# Altium project Stabilizer.PrjPCB (part 3 of 5)

## Sheet RMII_Ethernet.SchDoc: Stabilizer
size 420 x 297 mm; Author: G.Kasprowicz; CompanyName: WUT ISE; DrawnBy: G.Kasprowicz; Organization: WUT ISE; Address1: PW ISE; Address2: Nowowiejska 15/19 00-665 Warsaw; Address3: gkasprow@gmail.com; DocumentNumber: 4; Revision: 3.4; SheetNumber: 4; SheetTotal: 11; ModifiedBy: -; CheckedDate: -; Title2: Ethernet; DivGrp: WUT ISE; Designer: G.Kasprowicz; ModifiedDate: -; ProjectName: Sensor Box
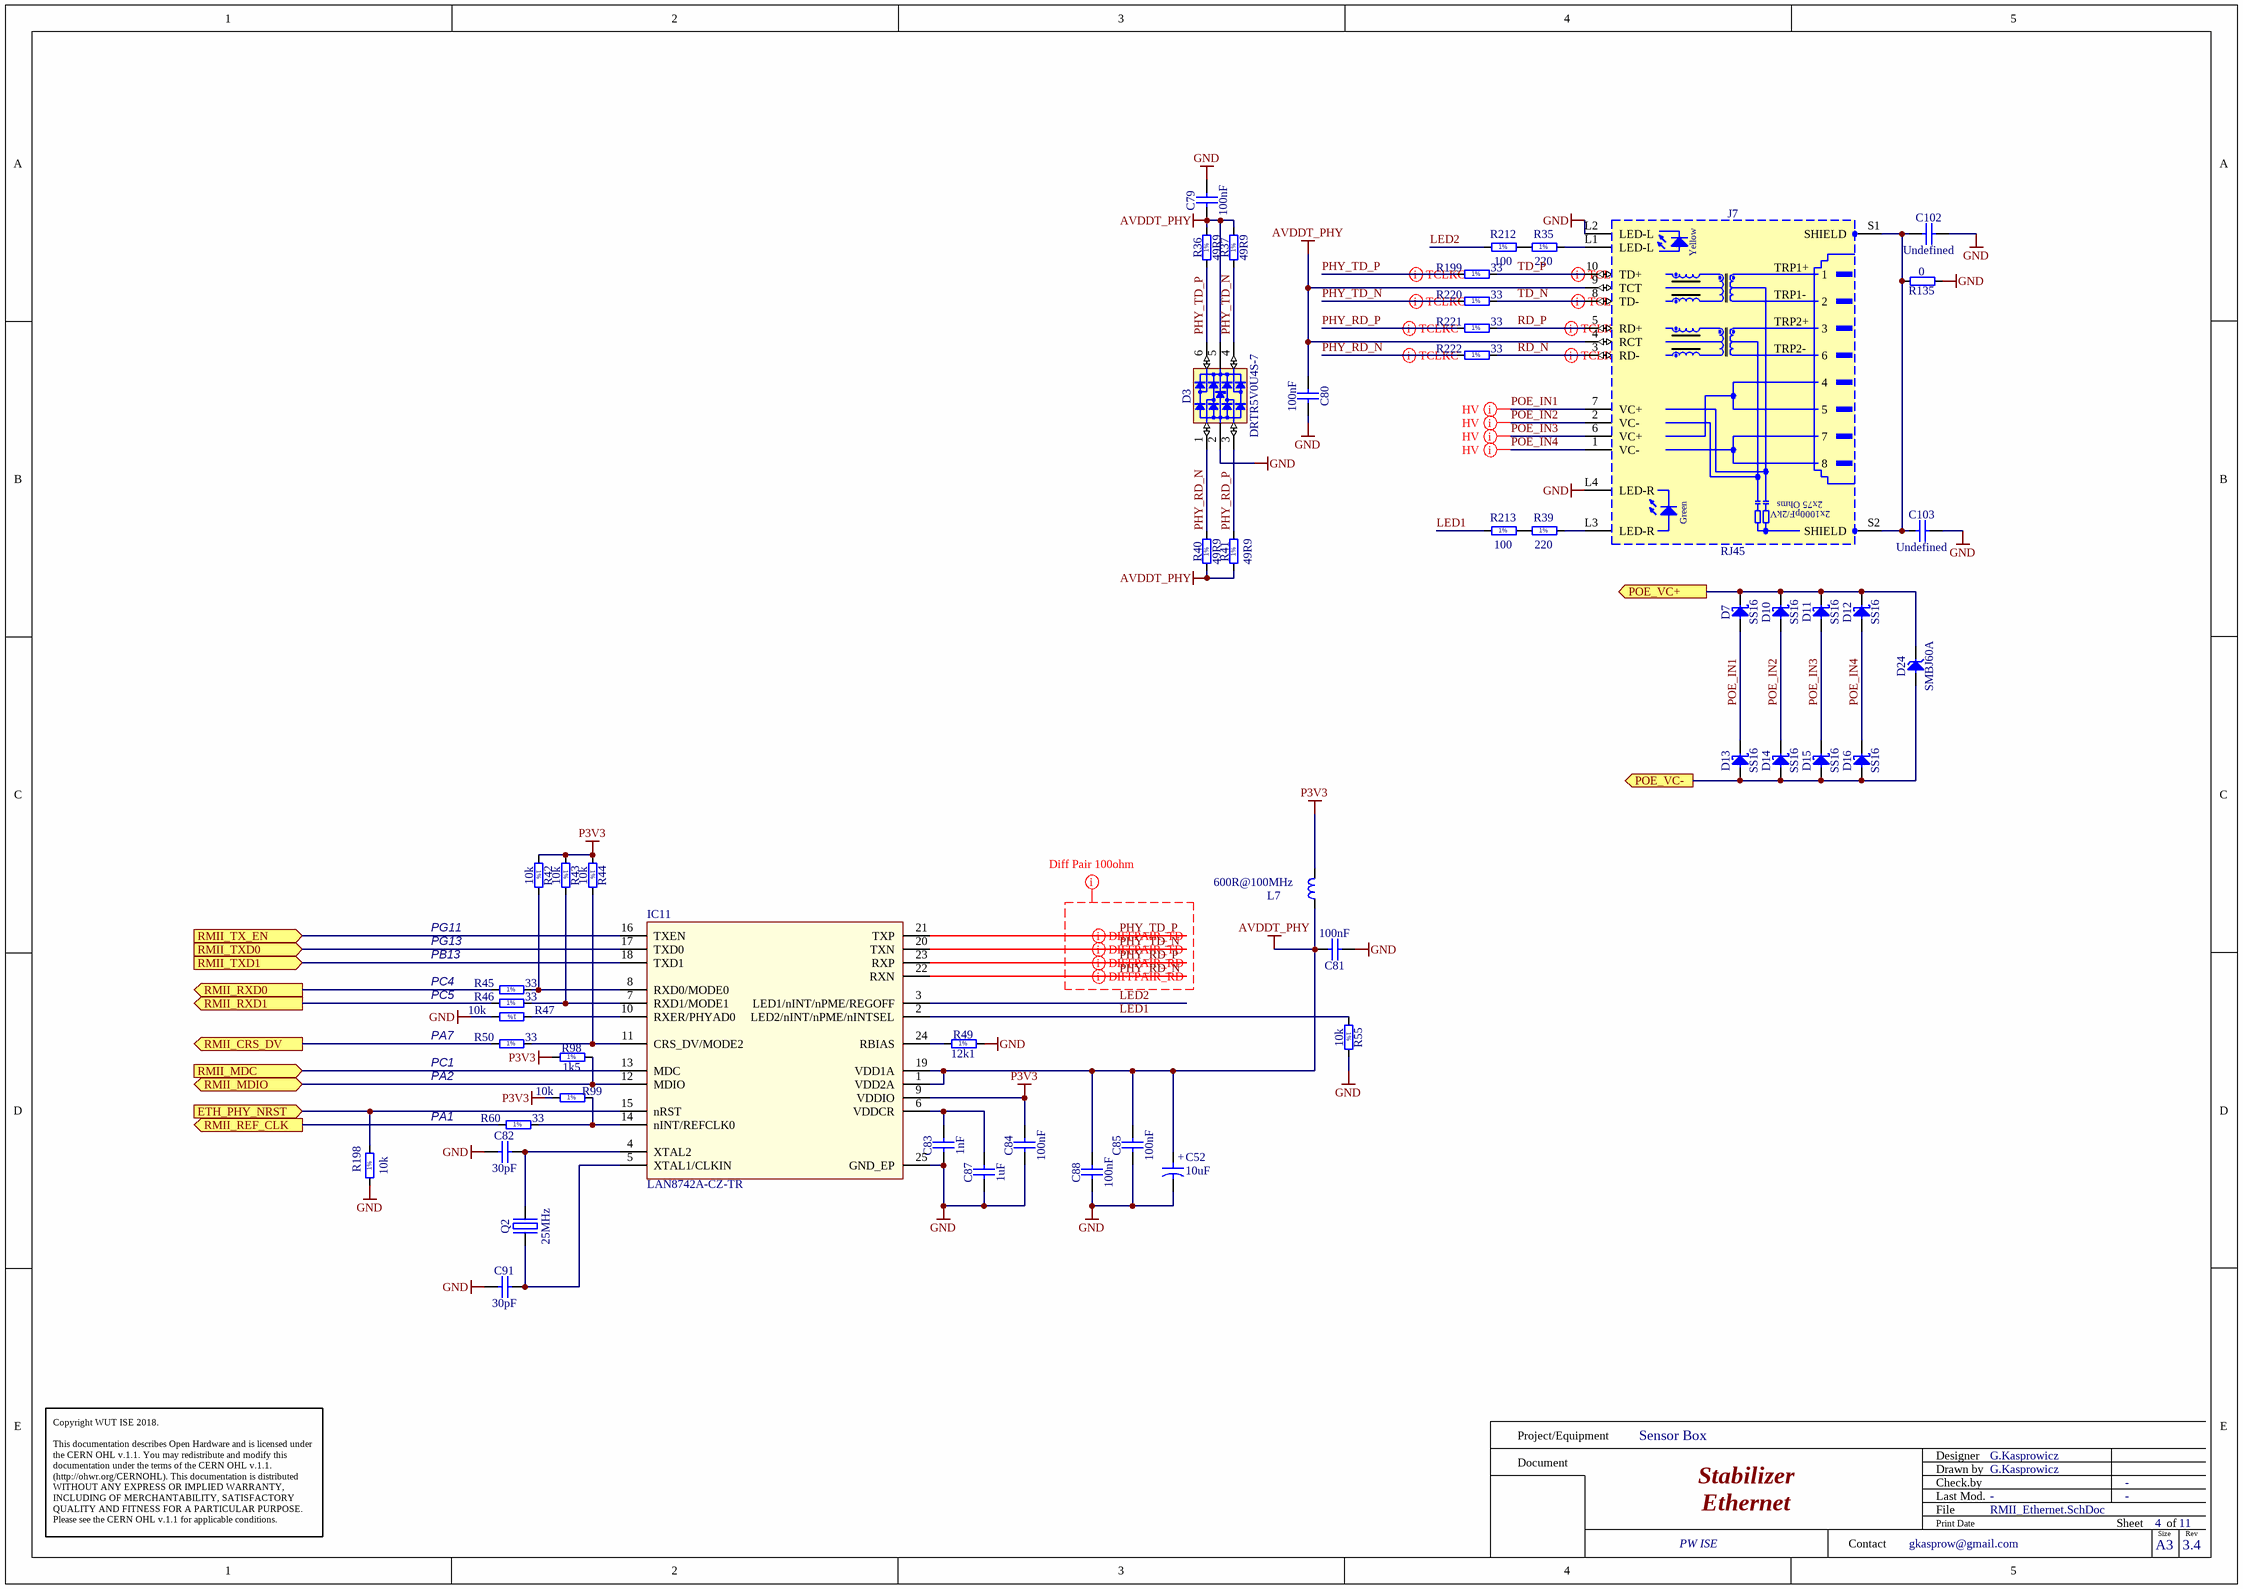
[diagram p2: RMII_Ethernet.SchDoc]

### Parts
C52  10uF  [CAPMP3216X180N]
C79  100nF  [CAPC1005X55N]
C80  100nF  [CAPC1005X55N]
C81  100nF  [CAPC1005X55N]
C82  30pF  [CAPC1005X55N]
C83  1nF  [CAPC1005X55N]
C84  100nF  [CAPC1005X55N]
C85  100nF  [CAPC1005X55N]
C87  1uF  [CAPC1608X87N]
C88  100nF  [CAPC1005X55N]
C91  30pF  [CAPC1005X55N]
C102  Undefined  [CAPC2012X135N]
C103  Undefined  [CAPC2012X135N]
D3  DRTR5V0U4S-7  [SOT65P210X110-6N]
D7  SS16  [DIOM5127X229N]
D10  SS16  [DIOM5127X229N]
D11  SS16  [DIOM5127X229N]
D12  SS16  [DIOM5127X229N]
D13  SS16  [DIOM5127X229N]
D14  SS16  [DIOM5127X229N]
D15  SS16  [DIOM5127X229N]
D16  SS16  [DIOM5127X229N]
D24  SMBJ60A  [DIOM5336X265N]
IC11  LAN8742A-CZ-TR  [QFN24_0R5_4X4]
J7  RJ45  [ABRACON_ARJM11C7-114-BA-EW2]
L7  600R@100MHz  [INDC1005X55N]
Q2  25MHz  [XTAL_ABRACON_ABLS]
R35  220  [RESC1608X55N]
R36  49R9  [RESC1005X40N]
R37  49R9  [RESC1005X40N]
R39  220  [RESC1608X55N]
R40  49R9  [RESC1005X40N]
R41  49R9  [RESC1005X40N]
R42  10k  [RESC1005X40N]
R43  10k  [RESC1005X40N]
R44  10k  [RESC1005X40N]
R45  33  [RESC1005X40N]
R46  33  [RESC1005X40N]
R47  10k  [RESC1005X40N]
R49  12k1  [RESC1005X40N]
R50  33  [RESC1005X40N]
R55  10k  [RESC1005X40N]
R60  33  [RESC1005X40N]
R98  1k5  [RESC1005X40N]
R99  10k  [RESC1005X40N]
R135  0  [RESC1608X55N]
R198  10k  [RESC1005X40N]
R199  33  [RESC1005X40N]
R212  100  [RESC1005X40N]
R213  100  [RESC1005X40N]
R220  33  [RESC1005X40N]
R221  33  [RESC1005X40N]
R222  33  [RESC1005X40N]

### Ports
ETH_PHY_NRST (in), POE_VC+ (out), POE_VC- (out), RMII_CRS_DV (out), RMII_MDC (in), RMII_MDIO (bidir), RMII_REF_CLK (out), RMII_RXD0 (out), RMII_RXD1 (out), RMII_TX_EN (in), RMII_TXD0 (in), RMII_TXD1 (in)

### Nets
AVDDT_PHY: C52.1 C79.1 C80.2 C81.2 C85.2 C88.2 D3.5(VBUS) IC11.1(VDD2A) IC11.19(VDD1A) J7.4(RCT) J7.9(TCT) L7.1 R36.2 R37.2 R40.1 R41.1
GND: C52.2 C79.2 C80.1 C81.1 C82.1 C83.1 C84.1 C85.1 C87.1 C88.1 C91.1 C102.2 C103.2 D3.2(GND) IC11.25(GND_EP) J7.L2(LED-L) J7.L4(LED-R) R47.2 R49.2 R55.2 R135.1 R198.1
P3V3: C84.2 IC11.9(VDDIO) L7.2 R42.1 R43.1 R44.1 R98.1 R99.1
ETH_PHY_NRST: IC11.15(nRST) R198.2 ; port ETH_PHY_NRST
LED1: IC11.2(LED2/nINT/nPME/nINTSEL) R55.1 R213.1
LED2: IC11.3(LED1/nINT/nPME/REGOFF) R212.1
PHY_RD_N: D3.1(I/O1) IC11.22(RXN) R40.2 R222.1
PHY_RD_P: D3.3(I/O2) IC11.23(RXP) R41.2 R221.1
PHY_TD_N: D3.4(I/O3) IC11.20(TXN) R37.1 R220.1
PHY_TD_P: D3.6(I/O4) IC11.21(TXP) R36.1 R199.1
POE_IN1: D7.2(A) D13.1(C) J7.7(VC+)
POE_IN2: D10.2(A) D14.1(C) J7.2(VC-)
POE_IN3: D11.2(A) D15.1(C) J7.6(VC+)
POE_IN4: D12.2(A) D16.1(C) J7.1(VC-)
POE_VC+: D7.1(C) D10.1(C) D11.1(C) D12.1(C) D24.1(C) ; port POE_VC+
POE_VC-: D13.2(A) D14.2(A) D15.2(A) D16.2(A) D24.2(A) ; port POE_VC-
RD_N: J7.3(RD-) R222.2
RD_P: J7.5(RD+) R221.2
RMII_CRS_DV: R50.1 ; port RMII_CRS_DV
RMII_MDC: IC11.13(MDC) ; port RMII_MDC
RMII_MDIO: IC11.12(MDIO) R98.2 ; port RMII_MDIO
RMII_REF_CLK: R60.1 ; port RMII_REF_CLK
RMII_RXD0: R45.1 ; port RMII_RXD0
RMII_RXD1: R46.1 ; port RMII_RXD1
RMII_TX_EN: IC11.16(TXEN) ; port RMII_TX_EN
RMII_TXD0: IC11.17(TXD0) ; port RMII_TXD0
RMII_TXD1: IC11.18(TXD1) ; port RMII_TXD1
TD_N: J7.8(TD-) R220.2
TD_P: J7.10(TD+) R199.2
NetC82_2: C82.2 IC11.4(XTAL2) Q2.2(OSC2)
NetC83_2: C83.2 C87.2 IC11.6(VDDCR)
NetC91_2: C91.2 IC11.5(XTAL1/CLKIN) Q2.1(OSC1)
NetC102_1: C102.1 C103.1 J7.S1(SHIELD) J7.S2(SHIELD) R135.2
NetIC11_7: IC11.7(RXD1/MODE1) R43.2 R46.2
NetIC11_8: IC11.8(RXD0/MODE0) R42.2 R45.2
NetIC11_10: IC11.10(RXER/PHYAD0) R47.1
NetIC11_11: IC11.11(CRS_DV/MODE2) R44.2 R50.2
NetIC11_14: IC11.14(nINT/REFCLK0) R60.2 R99.2
NetIC11_24: IC11.24(RBIAS) R49.1
NetJ7_L1: J7.L1(LED-L) R35.2
NetJ7_L3: J7.L3(LED-R) R39.2
NetR35_1: R35.1 R212.2
NetR39_1: R39.1 R213.2

### Layout directives
differential pair: PHY_RD_N, PHY_RD_P, PHY_TD_N, PHY_TD_P, RD_N, RD_P, TD_N, TD_P
net class HV: POE_IN1, POE_IN2, POE_IN3, POE_IN4
mark named Diff Pair 100ohm: PHY_RD_N, PHY_RD_P, PHY_TD_N, PHY_TD_P

### Notes on the sheet
- PG11
- PG13
- PB13
- PC4
- PC5
- PA7
- PC1
- PA2
- PA1
- Project/Equipment
- Document
- Designer
- Drawn by
- Check.by
- Copyright WUT ISE 2018.
  This documentation describes Open Hardware and is licensed under the CERN OHL v.1.1. You may redistribute and modify this documentation under the terms of the CERN OHL v.1.1. (http://ohwr.org/CERNOHL). This documentation is distributed WITHOUT ANY EXPRESS OR IMPLIED WARRANTY, INCLUDING OF MERCHANTABILITY, SATISFACTORY QUALITY AND FITNESS FOR A PARTICULAR PURPOSE. Please see the CERN OHL v.1.1 for applicable conditions.
- Contact
- File
- Last Mod.
- Print Date
- Sheet
- Size
- A3
- of
- Rev
- (in symbol CON_ETH_POE_ARJM11C7) Yellow; TRP1+; TRP1-; TRP2+; TRP2-; 2x75 Ohms; Green; 2x1000pF/2kV
- (in symbol CTE3216-18_10UF_16V_20%_AVX_TCJ) +
- (in symbol R0402_1K5_1%_0.0625W_100PPM) 1%
- (in symbol R0402_10K_1%_0.0625W_100PPM) 1%
- (in symbol R0402_12K1_1%_0.0625W_100PPM) 1%
- (in symbol R0402_33R_1%_0.0625W_100PPM) 1%
- (in symbol R0402_49R9_1%_0.0625W_100PPM) 1%
- (in symbol R0402_100R_1%_0.0625W_100PPM) 1%
- (in symbol R0603_220R_1%_0.1W_100PPM) 1%

### Library data of the parts
C52 = CTE3216-18_10UF_16V_20%_AVX_TCJ: Polarised capacitor; Part Description: ESR 0R200 Tantalum Solid Electrolytic Chip Capacitor with Conductive Polymer Electrode; Manufacturer: AVX; Manufacturer Part Number: TCJA106M016R0200; Voltage: 16V; Tolerance: ±20%; Part Number: CTE3216-18_10UF_16V_20%_AVX_TCJ; Component Kind: Standard; Component Type: Standard; Pin Count: 2; Value: 10uF; Status: Preferred; Case: A; Mounted: Yes; Socket: No; SMD: Yes; Sense: No; ComponentHeight: 1.8mm; HelpURL: \\cern.ch\dfs\Applications\Altium\Datasheets\CTE_AVX_TCJ.pdf; Author: CERN DEM JLC; CreateDate: 29.03.2012; LatestRevisionDate: 29.03.2012
C79-C81 C84 C85 C88 = CC0402_100NF_16V_10%_X5R: Non-polarised capacitor; Part Description: SMD Multilayer Chip Ceramic Capacitor; Manufacturer: GENERIC; Manufacturer1 Part Number: GRM155R61C104KA88D; Voltage: 16V; TC: X5R; Tolerance: ±10%; Part Number: CC0402_100NF_16V_10%_X5R; Component Kind: Standard; Component Type: Standard; Pin Count: 2; Value: 100nF; Status: None; Manufacturer Part Number: CC0402_100NF_16V_10%_X5R; Case: 0402; Mounted: Yes; Socket: No; SMD: Yes; Manufacturer1 Example: MURATA; Manufacturer1 ComponentHeight: 0.55mm; HelpURL: \\cern.ch\dfs\Applications\Altium\Datasheets\CC0402_X5R_MURATA_GRM.pdf; Author: CERN DEM JLC; Sense: No
  C79 C80: CreateDate: 10.12.2013; LatestRevisionDate: 10.12.2013
  C81 C84 C85 C88: CreateDate: 10/12/2013; LatestRevisionDate: 10/12/2013
C82 C91 = CC0402_30PF_50V_1%_C0G_MURATA_GJM1555C1H300FB01: Non-polarised capacitor; Part Description: High-Q SMD Chip Monolithic Ceramic Capacitor; Manufacturer: MURATA; Manufacturer Part Number: GJM1555C1H300FB01D; Voltage: 50V; TC: C0G/NP0; Tolerance: ±1%; Part Number: CC0402_30PF_50V_1%_C0G_MURATA_GJM1555C1H300FB01; Component Kind: Standard; Component Type: Standard; Pin Count: 2; Value: 30pF; Status: Not Recommended; Case: 0402; Mounted: Yes; Socket: No; SMD: Yes; Sense: No; ComponentHeight: 0.55mm; HelpURL: \\cern.ch\dfs\Applications\Altium\Datasheets\CC0402_MURATA_GJM1555C1H300FB01D.pdf; Author: CERN DEM BC; CreateDate: 20/11/2017; LatestRevisionDate: 20/11/2017
C83 = CC0402_1NF_50V_10%_X7R: Non-polarised capacitor; Part Description: SMD Multilayer Chip Ceramic Capacitor; Manufacturer: GENERIC; Manufacturer1 Part Number: 223858715623; Voltage: 50V; TC: X7R; Tolerance: ±10%; Part Number: CC0402_1NF_50V_10%_X7R; Component Kind: Standard; Component Type: Standard; Pin Count: 2; Value: 1nF; Status: Not Recommended; Manufacturer Part Number: CC0402_1NF_50V_10%_X7R; Case: 0402; Mounted: Yes; Socket: No; SMD: Yes; Sense: No; Manufacturer1 Example: PHYCOMP; Manufacturer1 ComponentHeight: 0.55mm; HelpURL: \\cern.ch\dfs\Applications\Altium\Datasheets\CC0402_X7R_PHYCOMP.pdf; Author: CERN DEM JLC; CreateDate: 03/12/2007; LatestRevisionDate: 03/12/2007
C87 = CC0603_1UF_16V_10%_X7R: Non-polarised capacitor; Part Description: SMD Multilayer Chip Ceramic Capacitor; Manufacturer: GENERIC; Manufacturer1 Part Number: 223878615663; Voltage: 16V; TC: X7R; Tolerance: ±10%; Part Number: CC0603_1UF_16V_10%_X7R; Component Kind: Standard; Component Type: Standard; Pin Count: 2; Value: 1uF; Status: None; Manufacturer Part Number: CC0603_1uF_16V_10%_X7R; Case: 0603; Mounted: Yes; Socket: No; SMD: Yes; Sense: No; Manufacturer1 Example: YAGEO PHYCOMP; Manufacturer1 ComponentHeight: 0.9mm; HelpURL: \\cern.ch\dfs\Applications\Altium\Datasheets\CC0603_X7R_PHYCOMP.pdf; Author: CERN DEM JLC; CreateDate: 03/12/2007; LatestRevisionDate: 17/04/2015
C102 C103 = CC0805_NO-VALUE: Non-polarised capacitor; Part Description: Reserved Footprint For 0805(2012) Chip Ceramic Capacitor; Mounted: No; Part Number: CC0805_NO-VALUE; Component Kind: Standard; Component Type: Standard; Pin Count: 2; Value: Undefined; Status: None; Manufacturer: Undefined; Manufacturer Part Number: CC0805_NO-VALUE; Case: 0805; Socket: No; SMD: Yes; Sense: No; Manufacturer1 ComponentHeight: 1.35mm; HelpURL: Undefined; Author: CERN DEM JLC; CreateDate: 10.12.2008; LatestRevisionDate: 11.09.2013
D3 = D_TVS_DRTR5V0U4S-7: Integrated Quad Ultra-Low Capacitance ESD Protection; Part Description: Integrated Quad Ultra-Low Capacitance ESD (±8kV) Protection; Manufacturer: DIODES; PressFit: No; Bonding: No; Status Comment: Active; Part Number: DRTR5V0U4S-7; Component Kind: Standard; Component Type: Standard; Device: DRTR5V0U4S-7; PackageDescription: SOT363, SC70-6, 0.65mm Pitch; 6 Pin, 1.25mm W X 2.00mm L X 1.10mm H body, IPC Medium Density; Status: Active; Manufacturer Part Number: DRTR5V0U4S-7; Pin Count: 6; Case: SOT363; Mounted: Yes; Socket: No; SMD: Yes; Sense: No; ComponentHeight: 1.1mm; HelpURL: \\cern.ch\dfs\Applications\Altium\Datasheets\PRTR5V0U4Y.pdf; Author: GK; CreateDate: 24.01.2017; LatestRevisionDate: 14.09.2020
D7 D10-D16 = SS16: Schottky Diode; Part Description: Surface Mount Schottky Barrier Rectifier; Manufacturer: VISHAY GENERAL SEMICONDUCTOR; Voltage: 60V; Power: 1A; PressFit: No; Bonding: No; Part Number: SS16; Component Kind: Standard; Component Type: Standard; Device: SS16; PackageDescription: DO-214-AC Molded Diode, Body 5.1x2.7mm, IPC Medium Density; Manufacturer Part Number: SS16; Pin Count: 2; Case: DO-214AC; Mounted: Yes; Socket: No; SMD: Yes; Sense: No; ComponentHeight: 2.29mm; HelpURL: \\cern.ch\dfs\Applications\Altium\Datasheets\SS16.pdf; Author: CERN DEM JLC; CreateDate: 15.07.2008; LatestRevisionDate: 23.08.2010
D24 = SMBJ60A: Zener Diode; Part Description: Uni-Directional Transient Voltage Suppressor Diode; Manufacturer: FAIRCHILD SEMICONDUCTOR; Voltage: 60V; Power: 600W; PressFit: No; Bonding: No; Part Number: SMBJ60A; Component Kind: Standard; Component Type: Standard; Device: SMBJ60A; PackageDescription: DO-214-AA/SMB Diode, Molded Body; 5.34mm L X 3.625mm W X 2.65mm H, IPC Medium Density; Manufacturer Part Number: SMBJ60A; Pin Count: 2; Case: DO-214AA; Mounted: Yes; Socket: No; SMD: Yes; Sense: No; ComponentHeight: 2.65mm; HelpURL: \\cern.ch\dfs\Applications\Altium\Datasheets\SMBJ.pdf; Author: CERN DEM JLC; CreateDate: 30.06.2008; LatestRevisionDate: 19.12.2011
IC11 = IFC_LAN8742A: LAN8742A-CZ-TR - Small Footprint RMII 10/100 Ethernet, Transceiver with HP Auto-MDIX and flexPWR Technology SQFN-24; Manuf_1: MICROCHIP; Order: LAN8742A-CZ-TR; Manuf_Part_1: LAN8742A-CZ-TR; Distrib: MICROCHIP
J7 = CON_ETH_POE_ARJM11C7: MagJack 10/100BaseT, PoE+, 1X1, OG/Y, -40 to 85*C, Tab Up, RoHS; Part Number: ARJM11C7-114-BA-EW2; Part Description: 1 Port, Orange Green/Yellow LEDs, RJ45 10/100BaseT, PoE, Ethernet MagJack® Connector Module; Manufacturer: Abracon; PressFit: No; Component Kind: Standard; Component Type: Standard; Pin Count: 18; Family: RJ45; Mounted: Yes; Socket: No; SMD: No; Sense: No; Status: None; Manufacturer Part Number: ARJM11C7-114-BA-EW2; ComponentHeight: 13.61mm; HelpURL: \\cern.ch\dfs\Applications\Altium\Datasheets\BELFUSE_0826-1X1T-GJ-F.pdf; Author: GK; CreateDate: 05.11.2012; LatestRevisionDate: 05.11.2012
L7 = IND0402_MURATA_BLM15HD601SN1: Inductor; Part Description: SMD EMIFIL Suppression Chip Ferrite Bead; Manufacturer: MURATA; Manufacturer Part Number: BLM15HD601SN1D; Power: 300mA; Resistance: 0.85R; Tolerance: ±25%; Part Number: IND0402_MURATA_BLM15HD601SN1; Component Kind: Standard; Component Type: Standard; Pin Count: 2; Value: 600R@100MHz; Status: None; Case: 0402; Mounted: Yes; Socket: No; SMD: Yes; Sense: No; ComponentHeight: 0.55mm; HelpURL: \\cern.ch\dfs\Applications\Altium\Datasheets\IND0402_MURATA_BLM15H.pdf; Author: CERN DEM JLC; CreateDate: 28/02/2012; LatestRevisionDate: 28/02/2012
Q2 = XTAL_25MHZ_ABRACON_ABLS-25.000MHZ-B2F-T: Quartz Crystal; Part Description: Tolerance: ± 20ppm, Stability: ± 50ppm, -20°C to +70°C, 18pF, 40 Ohms ESR, Low Profile Surface Mount Microprocessor Crystal, ABLS Series; PressFit: No; Bonding: No; Part Number: XTAL_25MHZ_ABRACON_ABLS-25.000MHZ-B2F-T; Component Kind: Standard; Component Type: Standard; PackageDescription: SMD Crystal, Body 11.40mm L X 4.70mm W X 4.20mm H, HC/49US (AT49) ALBS Series; Value: 25MHz; Manufacturer: ABRACON; Manufacturer Part Number: ABLS-25.000MHZ-B2F-T; Pin Count: 2; Mounted: Yes; Socket: No; SMD: Yes; Sense: No; ComponentHeight: 4.2mm; HelpURL: \\cern.ch\dfs\Applications\Altium\Datasheets\XTAL_ABRACON_ABLS.pdf; Author: CERN DEM JLC; CreateDate: 03/06/2010; LatestRevisionDate: 15/02/2018
R35 R39 = R0603_220R_1%_0.1W_100PPM: Resistor - 1%; Part Description: General Purpose Thick Film Chip Resistor; Manufacturer: GENERIC; Manufacturer1 Part Number: NRC06F2200TRF; Power: 0.1W; TC: ±100ppm/°C; PressFit: No; Part Number: R0603_220R_1%_0.1W_100PPM; Component Kind: Standard; Component Type: Standard; Pin Count: 2; Value: 220; Status: Preferred; Tolerance: ±1%; Manufacturer Part Number: R0603_220R_1%_0.1W_100PPM; Case: 0603; Mounted: Yes; Sense: No; Socket: No; SMD: Yes; Manufacturer1 Example: NIC COMPONENT; Manufacturer1 ComponentHeight: 0.55mm; HelpURL: \\cern.ch\dfs\Applications\Altium\Datasheets\R0603_NIC_NRC.pdf; Author: CERN DEM JLC; CreateDate: 03.12.2007; LatestRevisionDate: 13.03.2008
R36 R37 R40 R41 = R0402_49R9_1%_0.0625W_100PPM: Resistor - 1%; Part Description: General Purpose Thick Film Chip Resistor; Manufacturer: GENERIC; Manufacturer1 Part Number: 232270674999L or RC0402FR-0749R9L; TC: ±100ppm/°C; Table: Resistors SMD; Part Number: R0402_49R9_1%_0.0625W_100PPM; Component Kind: Standard; Component Type: Standard; Pin Count: 2; Value: 49R9; Status: Not recommended; Power: 0.0625W; Tolerance: ±1%; Manufacturer Part Number: R0402_49R9_1%_0.0625W_100PPM; Case: 0402; Mounted: Yes; Socket: No; SMD: Yes; Manufacturer1 Example: YAGEO PHYCOMP; Manufacturer1 ComponentHeight: 0.4mm; HelpURL: \\cern.ch\dfs\Applications\Altium\Datasheets\R0402_Phycomp_RC0402.pdf; Author: CERN DEM JLC; CreateDate: 2012-10-24; LatestRevisionDate: 2012-10-24
R42-R44 R47 R55 R99 R198 = R0402_10K_1%_0.0625W_100PPM: Resistor - 1%; Part Description: General Purpose Thick Film Chip Resistor; Manufacturer: GENERIC; Manufacturer1 Part Number: 232270671003L; TC: ±100ppm/°C; PressFit: No; Value: 10k; Part Number: R0402_10K_1%_0.0625W_100PPM; Component Kind: Standard; Component Type: Standard; Pin Count: 2; Status: Not Recommended; Power: 0.0625W; Tolerance: ±1%; Manufacturer Part Number: R0402_10K_1%_0.0625W_100PPM; Case: 0402; Mounted: Yes; Sense: No; Socket: No; SMD: Yes; Manufacturer1 Example: YAGEO PHYCOMP; Manufacturer1 ComponentHeight: 0.4mm; HelpURL: \\cern.ch\dfs\Applications\Altium\Datasheets\R0402_Phycomp_RC0402.pdf; Author: CERN DEM JLC; CreateDate: 03/12/2007; LatestRevisionDate: 17/10/2012
R45 R46 R50 R60 R199 R220-R222 = R0402_33R_1%_0.0625W_100PPM: Resistor - 1%; Part Description: General Purpose Thick Film Chip Resistor; Manufacturer: GENERIC; Manufacturer1 Part Number: 232270673309L; TC: ±100ppm/°C; PressFit: No; Part Number: R0402_33R_1%_0.0625W_100PPM; Component Kind: Standard; Component Type: Standard; Pin Count: 2; Value: 33; Status: Not Recommended; Power: 0.0625W; Tolerance: ±1%; Manufacturer Part Number: R0402_33R_1%_0.0625W_100PPM; Case: 0402; Mounted: Yes; Sense: No; Socket: No; SMD: Yes; Manufacturer1 Example: YAGEO PHYCOMP; Manufacturer1 ComponentHeight: 0.4mm; HelpURL: \\cern.ch\dfs\Applications\Altium\Datasheets\R0402_Phycomp_RC0402.pdf; Author: CERN DEM JLC; CreateDate: 03/12/2007; LatestRevisionDate: 17/10/2012
R49 = R0402_12K1_1%_0.0625W_100PPM: Resistor - 1%; Part Description: General Purpose Thick Film Chip Resistor; Manufacturer: GENERIC; Manufacturer1 Part Number: 232270671213L or RC0402FR-0712K1L; TC: ±100ppm/°C; PressFit: No; Part Number: R0402_12K1_1%_0.0625W_100PPM; Component Kind: Standard; Component Type: Standard; Pin Count: 2; Value: 12k1; Status: Not Recommended; Power: 0.0625W; Tolerance: ±1%; Manufacturer Part Number: R0402_12K1_1%_0.0625W_100PPM; Case: 0402; Mounted: Yes; Sense: No; Socket: No; SMD: Yes; Manufacturer1 Example: YAGEO PHYCOMP; Manufacturer1 ComponentHeight: 0.4mm; HelpURL: \\cern.ch\dfs\Applications\Altium\Datasheets\R0402_Phycomp_RC0402.pdf; Author: CERN DEM JLC; CreateDate: 24/10/2012; LatestRevisionDate: 24/10/2012
R98 = R0402_1K5_1%_0.0625W_100PPM: Resistor - 1%; Part Description: General Purpose Thick Film Chip Resistor; Manufacturer: GENERIC; Manufacturer1 Part Number: 232270671502L; TC: ±100ppm/°C; PressFit: No; Part Number: R0402_1K5_1%_0.0625W_100PPM; Component Kind: Standard; Component Type: Standard; Pin Count: 2; Value: 1k5; Status: Not Recommended; Power: 0.0625W; Tolerance: ±1%; Manufacturer Part Number: R0402_1K5_1%_0.0625W_100PPM; Case: 0402; Mounted: Yes; Sense: No; Socket: No; SMD: Yes; Manufacturer1 Example: YAGEO PHYCOMP; Manufacturer1 ComponentHeight: 0.4mm; HelpURL: \\cern.ch\dfs\Applications\Altium\Datasheets\R0402_Phycomp_RC0402.pdf; Author: CERN DEM JLC; CreateDate: 03/12/2007; LatestRevisionDate: 17/10/2012
R135 = R0603_0R_JUMPER: Resistor; Part Description: 1A (0.05R Max DC Resistance) Zero Ohm Jumper; Manufacturer: GENERIC; Manufacturer1 Part Number: NRC06Z0; PressFit: No; Part Number: R0603_0R_JUMPER; Component Kind: Standard; Component Type: Standard; Pin Count: 2; Value: 0; Status: Preferred; Manufacturer Part Number: R0603_0R_JUMPER; Case: 0603; Mounted: Yes; Sense: No; Socket: No; SMD: Yes; Manufacturer1 Example: NIC COMPONENT; Manufacturer1 ComponentHeight: 0.55mm; HelpURL: \\cern.ch\dfs\Applications\Altium\Datasheets\R0603_NIC_NRC.pdf; Author: CERN DEM JLC; CreateDate: 03.12.2007; LatestRevisionDate: 13.03.2008
R212 R213 = R0402_100R_1%_0.0625W_100PPM: Resistor - 1%; Part Description: General Purpose Thick Film Chip Resistor; Manufacturer: GENERIC; Manufacturer1 Part Number: 232270671001L; TC: ±100ppm/°C; PressFit: No; Part Number: R0402_100R_1%_0.0625W_100PPM; Component Kind: Standard; Component Type: Standard; Pin Count: 2; Value: 100; Status: Not Recommended; Power: 0.0625W; Tolerance: ±1%; Manufacturer Part Number: R0402_100R_1%_0.0625W_100PPM; Case: 0402; Mounted: Yes; Sense: No; Socket: No; SMD: Yes; Manufacturer1 Example: YAGEO PHYCOMP; Manufacturer1 ComponentHeight: 0.4mm; HelpURL: \\cern.ch\dfs\Applications\Altium\Datasheets\R0402_Phycomp_RC0402.pdf; Author: CERN DEM JLC; CreateDate: 03.12.2007; LatestRevisionDate: 17.10.2012

## Sheet USB.SchDoc: Stabilizer
size 420 x 297 mm; Author: G.Kasprowicz; CompanyName: WUT ISE; DrawnBy: G.Kasprowicz; Organization: WUT ISE; Address1: PW ISE; Address2: Nowowiejska 15/19 00-665 Warsaw; Address3: gkasprow@gmail.com; DocumentNumber: 5; Revision: 3.4; SheetNumber: 5; SheetTotal: 11; ModifiedBy: -; CheckedDate: -; Title2: USB connector; DivGrp: WUT ISE; Designer: G.Kasprowicz; ModifiedDate: -; ProjectName: Sensor Box
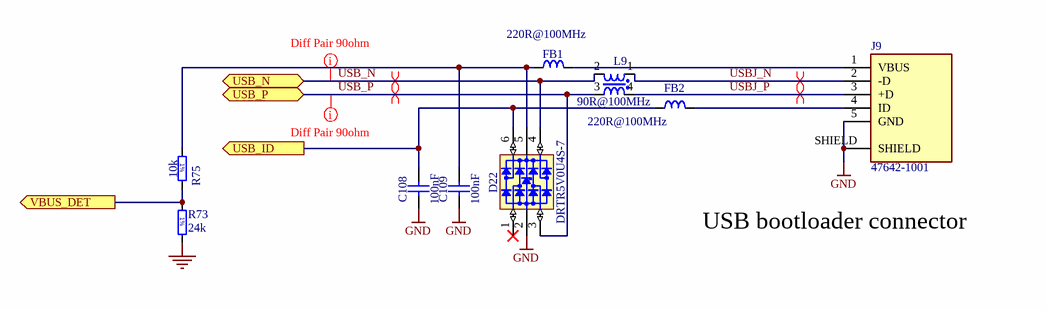
[diagram p3: USB.SchDoc]

### Parts
C108  100nF  [CAPC1005X55N]
C109  100nF  [CAPC1005X55N]
D22  DRTR5V0U4S-7  [SOT65P210X110-6N]
FB1  220R@100MHz  [INDC2012X105N]
FB2  220R@100MHz  [INDC2012X105N]
J9  47642-1001  [476421001]
L9  90R@100MHz  [IND_MURATA_DLW21S]
R73  24k  [RESC1608X55N]
R75  10k  [RESC1005X40N]

### Ports
USB_ID (out), USB_N (bidir), USB_P (bidir), VBUS_DET (out)

### Nets
GND: C108.1 C109.1 D22.2(GND) J9.5(GND) J9.SHIELD R73.2
USB_ID: C108.2 D22.6(I/O4) FB2.1 ; port USB_ID
USB_N: D22.4(I/O3) L9.2 ; port USB_N
USB_P: D22.3(I/O2) L9.3 ; port USB_P
USBJ_N: J9.2(-D) L9.1
USBJ_P: J9.3(+D) L9.4
VBUS_DET: R73.1 R75.2 ; port VBUS_DET
NetC109_2: C109.2 D22.5(VBUS) FB1.1 R75.1
NetFB1_2: FB1.2 J9.1(VBUS)
NetFB2_2: FB2.2 J9.4(ID)

Not connected (* = marked no-connect by the designer): D22 1(I/O1)*

### Layout directives
mark named Diff Pair 90ohm: USB_N, USB_P
differential pair: USB_N, USB_P, USBJ_N, USBJ_P

### Notes on the sheet
- USB bootloader connector
- Project/Equipment
- Document
- Designer
- Drawn by
- Check.by
- Copyright WUT ISE 2018.
  This documentation describes Open Hardware and is licensed under the CERN OHL v.1.1. You may redistribute and modify this documentation under the terms of the CERN OHL v.1.1. (http://ohwr.org/CERNOHL). This documentation is distributed WITHOUT ANY EXPRESS OR IMPLIED WARRANTY, INCLUDING OF MERCHANTABILITY, SATISFACTORY QUALITY AND FITNESS FOR A PARTICULAR PURPOSE. Please see the CERN OHL v.1.1 for applicable conditions.
- Contact
- File
- Last Mod.
- Print Date
- Sheet
- Size
- A3
- of
- Rev
- (in symbol R0402_10K_1%_0.0625W_100PPM) 1%
- (in symbol R0603_24K_1%_0.1W_100PPM) 1%

### Library data of the parts
C108 C109 = CC0402_100NF_16V_10%_X7R: Non-polarised capacitor; Part Description: SMD Multilayer Chip Ceramic Capacitor; Manufacturer: GENERIC; Manufacturer1 Part Number: GRM155R71C104KA88D; Voltage: 16V; TC: X7R; Tolerance: ±10%; Part Number: CC0402_100NF_16V_10%_X7R; Component Kind: Standard; Component Type: Standard; Pin Count: 2; Value: 100nF; Status: Not Recommended; Manufacturer Part Number: CC0402_100NF_16V_10%_X7R; Case: 0402; Mounted: Yes; Socket: No; SMD: Yes; Manufacturer1 Example: MURATA; Manufacturer1 ComponentHeight: 0.55mm; HelpURL: \\cern.ch\dfs\Applications\Altium\Datasheets\CC0402_X7R_MURATA_GRM.pdf; Author: CERN DEM JLC; CreateDate: 05.12.2013; LatestRevisionDate: 03.12.2007; Sense: No
D22 = D_TVS_DRTR5V0U4S-7: as D3 on sheet RMII_Ethernet; Part Number: DRTR5V0U4S-7; Component Kind: Standard; Component Type: Standard; Device: DRTR5V0U4S-7; PackageDescription: SOT363, SC70-6, 0.65mm Pitch; 6 Pin, 1.25mm W X 2.00mm L X 1.10mm H body, IPC Medium Density; Status: Active; Manufacturer Part Number: DRTR5V0U4S-7; Pin Count: 6; Case: SOT363; Mounted: Yes; Socket: No; SMD: Yes; Sense: No; ComponentHeight: 1.1mm; HelpURL: \\cern.ch\dfs\Applications\Altium\Datasheets\PRTR5V0U4Y.pdf; Author: GK; CreateDate: 24.01.2017; LatestRevisionDate: 14.09.2020
FB1 FB2 = IND0805_MURATA_BLM21PG221SN1D: Inductor; Part Description: SMD EMIFIL Suppression Chip Ferrite Bead; Manufacturer: MURATA; Power: 2A; Resistance: 0.05R; Tolerance: ±25%; Table: Inductors SMD; Part Number: IND0805_MURATA_BLM21PG221SN1D; Component Kind: Standard; Component Type: Standard; Pin Count: 2; Value: 220R@100MHz; Status: None; Manufacturer Part Number: BLM21PG221SN1D; Case: 0805; Mounted: Yes; Socket: No; SMD: Yes; ComponentHeight: 1.05mm; HelpURL: \\cern.ch\dfs\Applications\Altium\Datasheets\IND0402_MURATA_BLM21P.pdf; Author: CERN DEM JLC; CreateDate: 2010-01-25; LatestRevisionDate: 2010-01-25
J9 = 47642-1001: Connector; Manufacturer_Name: Molex; Datasheet Link: https://www.molex.com/pdm_docs/sd/476421001_sd.pdf; Height: 2.94mm; Manufacturer Part Number: 47642-1001; Mouser Part Number: 538-47642-1001; Mouser Price/Stock: https://www.mouser.co.uk/ProductDetail/Molex/47642-1001?qs=yd8XiKYcH9m5swOqK5ZC9Q%3D%3D
L9 = IND_MURATA_DLW21SN900SQ2L: Inductor Common Mode; Part Description: Wire Wound Common Mode Choke Coil (DLW21S Series); Manufacturer: MURATA; Power: 330mA; Resistance: 0.35R; Tolerance: ±25%; Part Number: IND_MURATA_DLW21SN900SQ2L; Component Kind: Standard; Component Type: Standard; Pin Count: 4; Value: 90R@100MHz; Status: None; Manufacturer Part Number: DLW21SN900SQ2L; Case: 0805; Mounted: Yes; Socket: No; SMD: Yes; Sense: No; ComponentHeight: 1.4mm; HelpURL: \\cern.ch\dfs\Applications\Altium\Datasheets\IND_MURATA_DLW21S.pdf; Author: CERN DEM JLC; CreateDate: 01.07.2014; LatestRevisionDate: 01.07.2014
R73 = R0603_24K_1%_0.1W_100PPM: Resistor - 1%; Part Description: General Purpose Thick Film Chip Resistor; Manufacturer: GENERIC; Manufacturer1 Part Number: NRC06F2402TRF; Power: 0.1W; TC: ±100ppm/°C; Part Number: R0603_24K_1%_0.1W_100PPM; Component Kind: Standard; Component Type: Standard; Pin Count: 2; Value: 24k; Status: Preferred; Tolerance: ±1%; Manufacturer Part Number: R0603_24K_1%_0.1W_100PPM; Case: 0603; Mounted: Yes; Sense: No; Socket: No; SMD: Yes; Manufacturer1 Example: NIC COMPONENT; Manufacturer1 ComponentHeight: 0.55mm; HelpURL: \\cern.ch\dfs\Applications\Altium\Datasheets\R0603_NIC_NRC.pdf; Author: CERN DEM JLC; CreateDate: 03.12.2007; LatestRevisionDate: 13.03.2008
R75 = R0402_10K_1%_0.0625W_100PPM: as R42-R44 on sheet RMII_Ethernet; Part Number: R0402_10K_1%_0.0625W_100PPM; Component Kind: Standard; Component Type: Standard; Pin Count: 2; Value: 10k; Status: Not Recommended; Power: 0.0625W; Tolerance: ±1%; Manufacturer Part Number: R0402_10K_1%_0.0625W_100PPM; Case: 0402; Mounted: Yes; Sense: No; Socket: No; SMD: Yes; Manufacturer1 Example: YAGEO PHYCOMP; Manufacturer1 ComponentHeight: 0.4mm; HelpURL: \\cern.ch\dfs\Applications\Altium\Datasheets\R0402_Phycomp_RC0402.pdf; Author: CERN DEM JLC; CreateDate: 03.12.2007; LatestRevisionDate: 17.10.2012

## Sheet CPU.SchDoc: Stabilizer
size 420 x 297 mm; Author: G.Kasprowicz; CompanyName: WUT ISE; DrawnBy: G.Kasprowicz; Organization: WUT ISE; Address1: PW ISE; Address2: Nowowiejska 15/19 00-665 Warsaw; Address3: gkasprow@gmail.com; DocumentNumber: 6; Revision: 3.4; SheetNumber: 6; SheetTotal: 11; ModifiedBy: -; CheckedDate: -; Title2: STM32 CPU; DivGrp: WUT ISE; Designer: G.Kasprowicz; ModifiedDate: -; ProjectName: Sensor Box
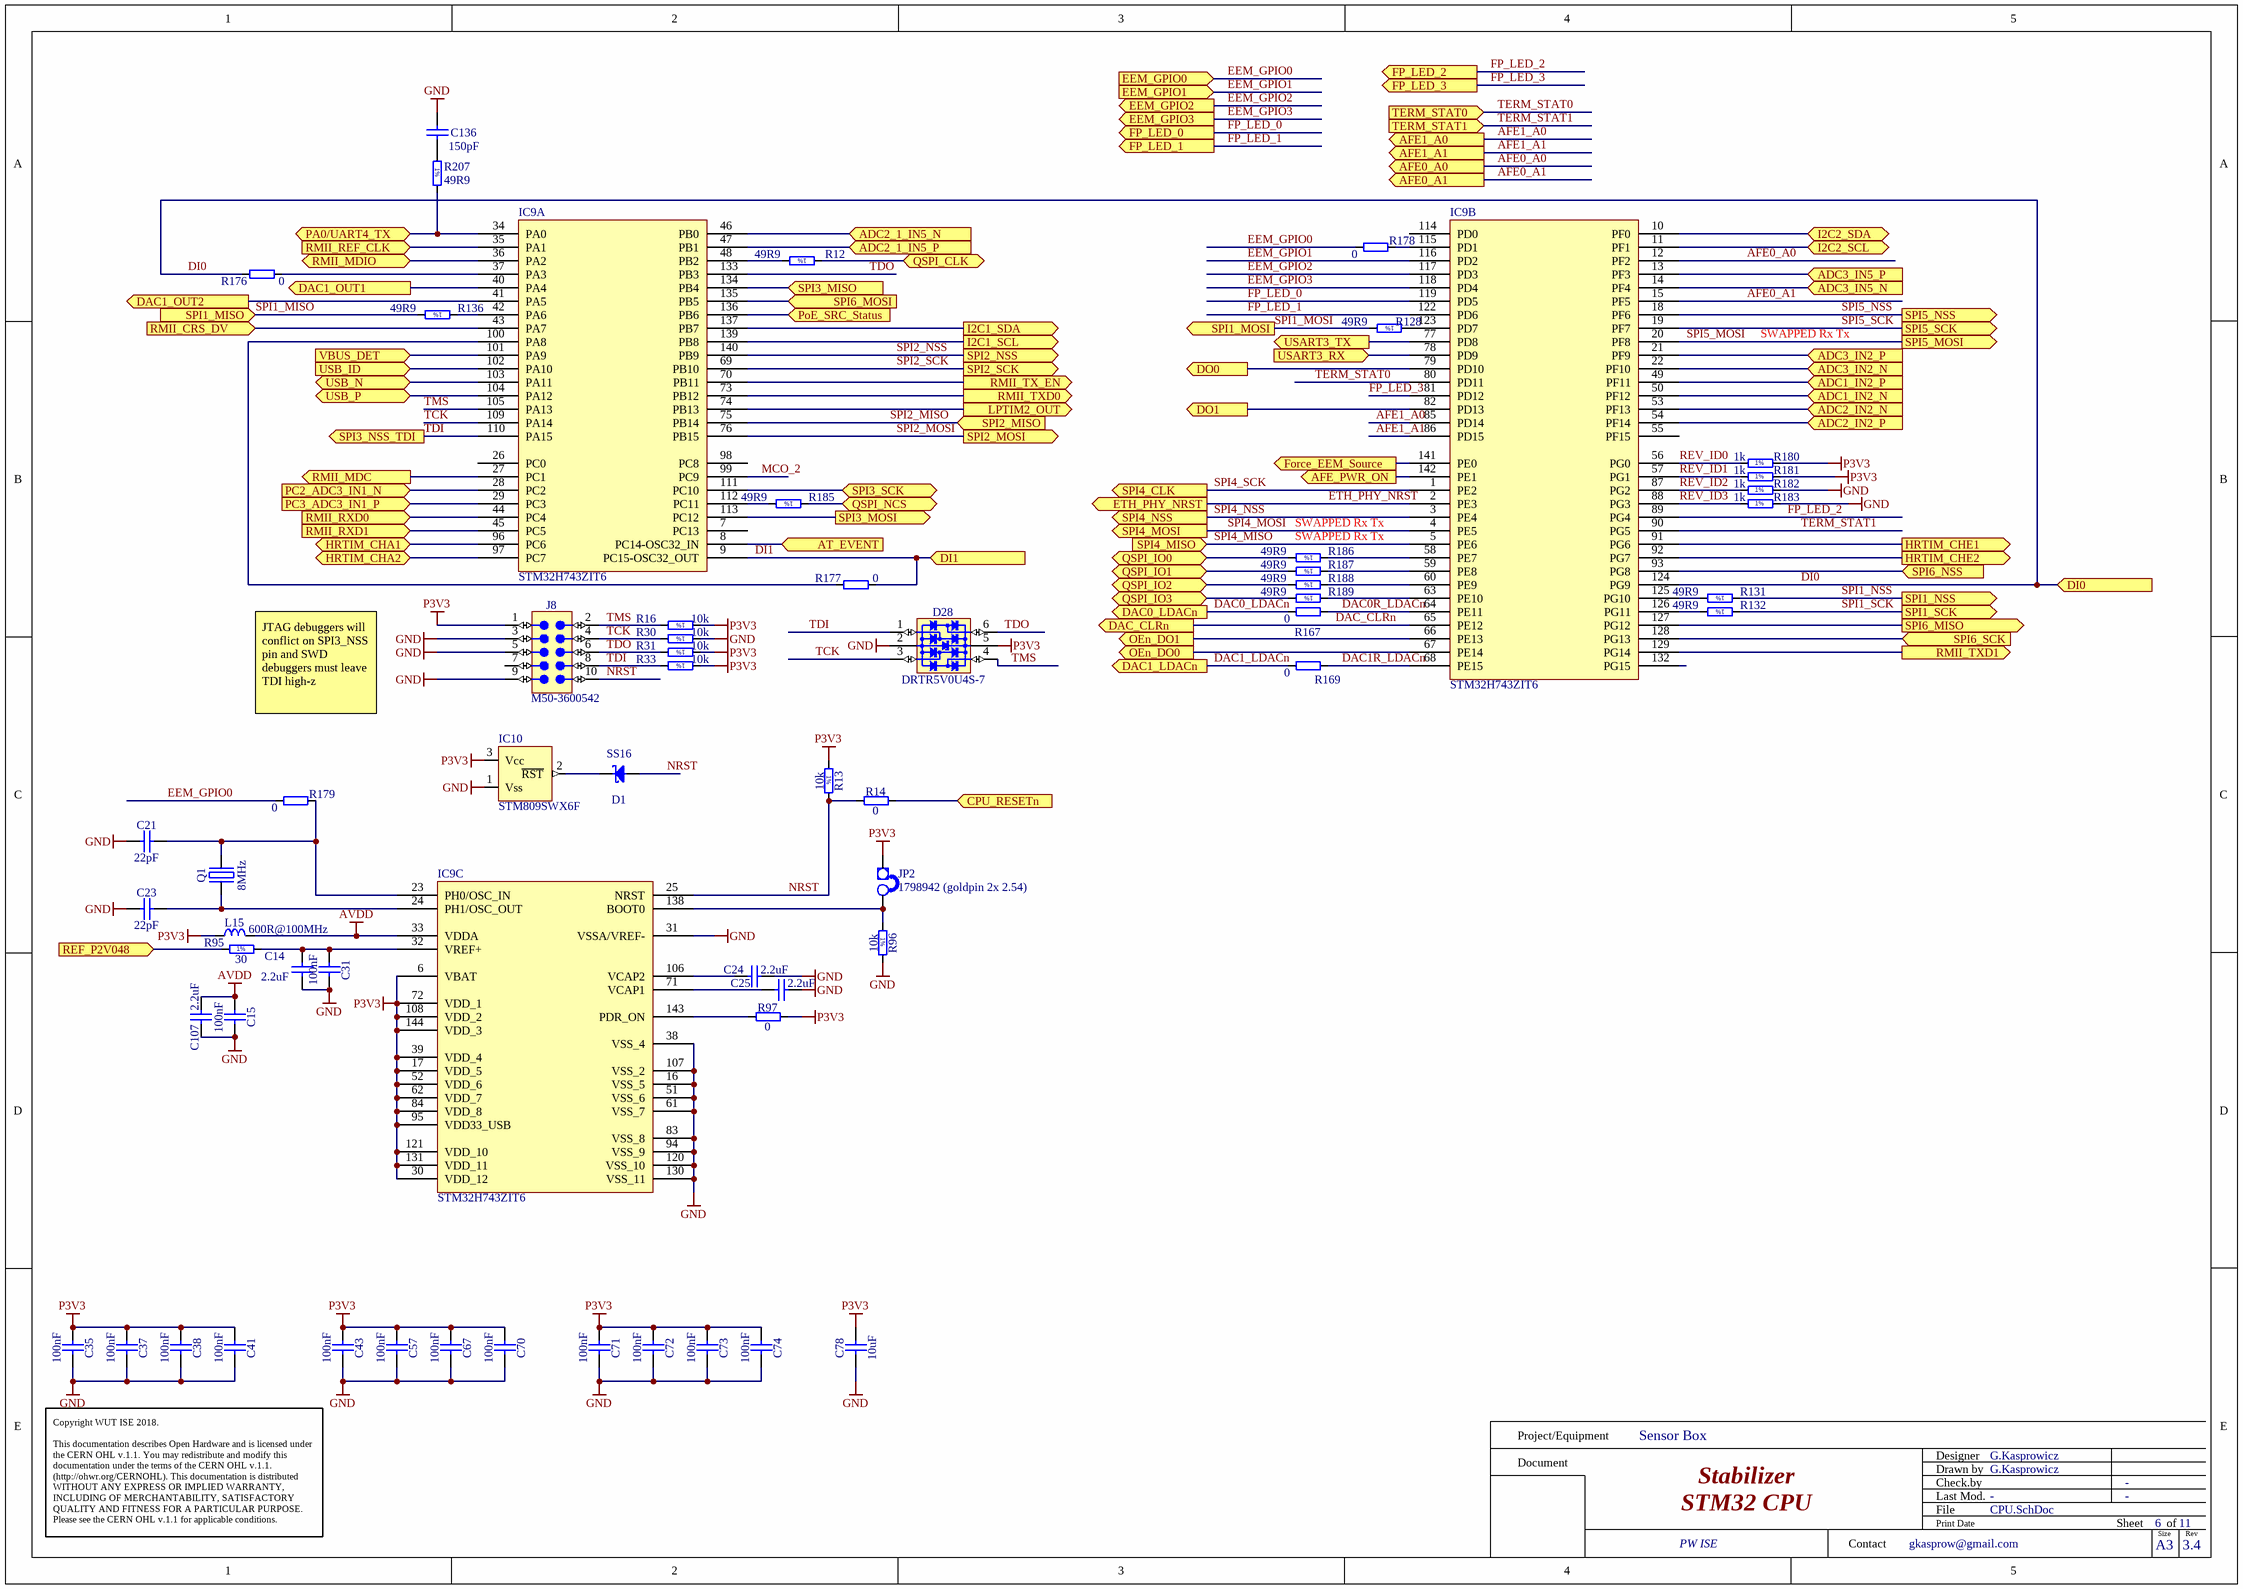
[diagram p4: CPU.SchDoc]

### Parts
C14  2.2uF  [CAPC1608X90N]
C15  100nF  [CAPC1005X55N]
C21  22pF  [CAPC1005X55N]
C23  22pF  [CAPC1005X55N]
C24  2.2uF  [CAPC1608X90N]
C25  2.2uF  [CAPC1608X90N]
C31  100nF  [CAPC1005X55N]
C35  100nF  [CAPC1005X55N]
C37  100nF  [CAPC1005X55N]
C38  100nF  [CAPC1005X55N]
C41  100nF  [CAPC1005X55N]
C43  100nF  [CAPC1005X55N]
C57  100nF  [CAPC1005X55N]
C67  100nF  [CAPC1005X55N]
C70  100nF  [CAPC1005X55N]
C71  100nF  [CAPC1005X55N]
C72  100nF  [CAPC1005X55N]
C73  100nF  [CAPC1005X55N]
C74  100nF  [CAPC1005X55N]
C78  10uF  [CAPC2012X95N]
C107  2.2uF  [CAPC1608X90N]
C136  150pF  [CAPC1608X87N]
D1  SS16  [DIOM5127X229N]
D28  DRTR5V0U4S-7  [SOT65P210X110-6N]
IC9  STM32H743ZIT6  [TSQFP50P2200X2200X160-144N]  (parts A,B,C of 3)
IC10  STM809SWX6F  [SOT-23]
J8  Manufacturer Part Number: M50-3600542  [HARWIN_M50-3600542]  (hidden comment: Header 10)
JP2  1798942 (goldpin 2x 2.54)  [jump]
L15  600R@100MHz  [INDC1005X55N]
Q1  8MHz  [XTAL_TXC_7A]
R12  49R9  [RESC1005X40N]
R13  10k  [RESC1005X40N]
R14  0  [RESC1005X40N]
R16  10k  [RESC1005X40N]
R30  10k  [RESC1005X40N]
R31  10k  [RESC1005X40N]
R33  10k  [RESC1005X40N]
R95  30  [RESC1608X55N]
R96  10k  [RESC1005X40N]
R97  0  [RESC1005X40N]
R128  49R9  [RESC1005X40N]
R131  49R9  [RESC1005X40N]
R132  49R9  [RESC1005X40N]
R136  49R9  [RESC1005X40N]
R167  0  [RESC1608X55N]
R169  0  [RESC1608X55N]
R176  0  [RESC1608X55N]
R177  0  [RESC1608X55N]
R178  0  [RESC1608X55N]
R179  0  [RESC1608X55N]
R180  1k  [RESC1608X55N]
R181  1k  [RESC1608X55N]
R182  1k  [RESC1608X55N]
R183  1k  [RESC1608X55N]
R185  49R9  [RESC1005X40N]
R186  49R9  [RESC1005X40N]
R187  49R9  [RESC1005X40N]
R188  49R9  [RESC1005X40N]
R189  49R9  [RESC1005X40N]
R207  49R9  [RESC1005X40N]

### Ports
ADC1_IN2_N (in), ADC1_IN2_P (in), ADC2_1_IN5_N (in), ADC2_1_IN5_P (in), ADC2_IN2_N (in), ADC2_IN2_P (in), ADC3_IN2_N (in), ADC3_IN2_P (in), ADC3_IN5_N (in), ADC3_IN5_P (in), AFE0_A0 (out), AFE0_A1 (out), AFE1_A0 (out), AFE1_A1 (out), AFE_PWR_ON (out), AT_EVENT (in), CPU_RESETn (in), DAC0_LDACn (out), DAC1_LDACn (out), DAC1_OUT1 (out), DAC1_OUT2 (out), DAC_CLRn (out), DI0 (in), DI1 (in), DO0 (out), DO1 (out), EEM_GPIO0 (in), EEM_GPIO1 (in), EEM_GPIO2 (out), EEM_GPIO3 (out), ETH_PHY_NRST (out), Force_EEM_Source (out), FP_LED_0 (out), FP_LED_1 (out), FP_LED_2 (out), FP_LED_3 (out), HRTIM_CHA1 (bidir), HRTIM_CHA2 (bidir), HRTIM_CHE1 (out), HRTIM_CHE2 (out), I2C1_SCL (out), I2C1_SDA (out), I2C2_SCL (bidir), I2C2_SDA (bidir), LPTIM2_OUT (out), OEn_DO0 (out), OEn_DO1 (out), PA0/UART4_TX (bidir), PC2_ADC3_IN1_N (in), PC3_ADC3_IN1_P (in), PoE_SRC_Status (in), QSPI_CLK (bidir), QSPI_IO0 (bidir), QSPI_IO1 (bidir), QSPI_IO2 (bidir), QSPI_IO3 (bidir), QSPI_NCS (bidir), REF_P2V048 (in), RMII_CRS_DV (in), RMII_MDC (out), RMII_MDIO (bidir), RMII_REF_CLK (in), RMII_RXD0 (in), RMII_RXD1 (in), RMII_TX_EN (out), RMII_TXD0 (out), RMII_TXD1 (out), SPI1_MISO (in), SPI1_MOSI (out), SPI1_NSS (out), SPI1_SCK (out), SPI2_MISO (in), SPI2_MOSI (out), SPI2_NSS (out), SPI2_SCK (out), SPI3_MISO (in), SPI3_MOSI (out), SPI3_NSS_TDI (out), SPI3_SCK (bidir), SPI4_CLK (out), SPI4_MISO (in), SPI4_MOSI (out), SPI4_NSS (out), SPI5_MOSI (out), SPI5_NSS (out), SPI5_SCK (out), SPI6_MISO (out), SPI6_MOSI (in), SPI6_NSS (in), SPI6_SCK (in), TERM_STAT0 (in), TERM_STAT1 (in), USART3_RX (in), USART3_TX (out), USB_ID (in), USB_N (bidir), USB_P (bidir), VBUS_DET (in)

### Nets
AVDD: C15.1 C107.2 IC9.33(VDDA) L15.2
GND: C14.1 C15.2 C21.1 C23.1 C24.2 C25.2 C31.2 C35.2 C37.2 C38.2 C41.2 C43.2 C57.2 C67.2 C70.2 C71.2 C72.2 C73.2 C74.2 C78.1 C107.1 C136.2 D28.2(GND) IC9.16(VSS_5) IC9.31(VSSA/VREF-) IC9.38(VSS_4) IC9.51(VSS_6) IC9.61(VSS_7) IC9.83(VSS_8) IC9.94(VSS_9) IC9.107(VSS_2) IC9.120(VSS_10) IC9.130(VSS_11) IC10.1(Vss) J8.3 J8.5 J8.9 R30.1 R96.2 R182.2 R183.2
P3V3: C35.1 C37.1 C38.1 C41.1 C43.1 C57.1 C67.1 C70.1 C71.1 C72.1 C73.1 C74.1 C78.2 D28.5(VBUS) IC9.6(VBAT) IC9.17(VDD_5) IC9.30(VDD_12) IC9.39(VDD_4) IC9.52(VDD_6) IC9.62(VDD_7) IC9.72(VDD_1) IC9.84(VDD_8) IC9.95(VDD33_USB) IC9.108(VDD_2) IC9.121(VDD_10) IC9.131(VDD_11) IC9.144(VDD_3) IC10.3(Vcc) J8.1 JP2.1(E1) L15.1 R13.1 R16.1 R31.1 R33.1 R97.2 R180.2 R181.2
ADC1_IN2_N: IC9.50(PF12) ; port ADC1_IN2_N
ADC1_IN2_P: IC9.49(PF11) ; port ADC1_IN2_P
ADC2_1_IN5_N: IC9.46(PB0) ; port ADC2_1_IN5_N
ADC2_1_IN5_P: IC9.47(PB1) ; port ADC2_1_IN5_P
ADC2_IN2_N: IC9.53(PF13) ; port ADC2_IN2_N
ADC2_IN2_P: IC9.54(PF14) ; port ADC2_IN2_P
ADC3_IN2_N: IC9.22(PF10) ; port ADC3_IN2_N
ADC3_IN2_P: IC9.21(PF9) ; port ADC3_IN2_P
ADC3_IN5_N: IC9.14(PF4) ; port ADC3_IN5_N
ADC3_IN5_P: IC9.13(PF3) ; port ADC3_IN5_P
AFE0_A0: IC9.12(PF2) ; port AFE0_A0
AFE0_A1: IC9.15(PF5) ; port AFE0_A1
AFE1_A0: IC9.85(PD14) ; port AFE1_A0
AFE1_A1: IC9.86(PD15) ; port AFE1_A1
AFE_PWR_ON: IC9.142(PE1) ; port AFE_PWR_ON
AT_EVENT: IC9.8(PC14-OSC32_IN) ; port AT_EVENT
CPU_REF_P2V048: R95.1 ; port REF_P2V048
CPU_RESETn: R14.2 ; port CPU_RESETn
CSN: IC9.93(PG8) ; port SPI6_NSS
DAC0_LDACn: R167.1 ; port DAC0_LDACn
DAC0R_LDACn: IC9.64(PE11) R167.2
DAC1_LDACn: R169.1 ; port DAC1_LDACn
DAC1_OUT1: IC9.40(PA4) ; port DAC1_OUT1
DAC1_OUT2: IC9.41(PA5) ; port DAC1_OUT2
DAC1R_LDACn: IC9.68(PE15) R169.2
DAC_CLRn: IC9.65(PE12) ; port DAC_CLRn  [project net CLRn]
DI0: IC9.124(PG9) R176.2 ; port DI0
DI1: IC9.9(PC15-OSC32_OUT) R177.1 ; port DI1
DO0: IC9.79(PD10) ; port DO0
DO1: IC9.82(PD13) ; port DO1
EEM_GPIO0: R178.1 R179.1 ; port EEM_GPIO0
EEM_GPIO1: IC9.116(PD2) ; port EEM_GPIO1
EEM_GPIO2: IC9.117(PD3) ; port EEM_GPIO2
EEM_GPIO3: IC9.118(PD4) ; port EEM_GPIO3
ETH_PHY_NRST: IC9.2(PE3) ; port ETH_PHY_NRST
Force_EEM_Source: IC9.141(PE0) ; port Force_EEM_Source
FP_LED_0: IC9.119(PD5) ; port FP_LED_0
FP_LED_1: IC9.122(PD6) ; port FP_LED_1
FP_LED_2: IC9.89(PG4) ; port FP_LED_2
FP_LED_3: IC9.81(PD12) ; port FP_LED_3
HRTIM_CHA1: IC9.96(PC6) ; port HRTIM_CHA1
HRTIM_CHA2: IC9.97(PC7) ; port HRTIM_CHA2
HRTIM_CHE1: IC9.91(PG6) ; port HRTIM_CHE1
HRTIM_CHE2: IC9.92(PG7) ; port HRTIM_CHE2
I2C1_SCL: IC9.139(PB8) ; port I2C1_SCL
I2C1_SDA: IC9.137(PB7) ; port I2C1_SDA
I2C2_SCL: IC9.11(PF1) ; port I2C2_SCL
I2C2_SDA: IC9.10(PF0) ; port I2C2_SDA
LPTIM2_OUT: IC9.74(PB13) ; port LPTIM2_OUT
MCO_2: IC9.99(PC9)
NRST: D1.2(A) IC9.25(NRST) J8.10 R13.2 R14.1
OEn_DO0: IC9.67(PE14) ; port OEn_DO0
OEn_DO1: IC9.66(PE13) ; port OEn_DO1
PA0/UART4_TX: IC9.34(PA0) R207.2 ; port PA0/UART4_TX
PC2_ADC3_IN1_N: IC9.28(PC2) ; port PC2_ADC3_IN1_N
PC3_ADC3_IN1_P: IC9.29(PC3) ; port PC3_ADC3_IN1_P
PoE_SRC_Status: IC9.136(PB6) ; port PoE_SRC_Status
QSPI_CLK: R12.1 ; port QSPI_CLK
QSPI_IO0: R186.2 ; port QSPI_IO0
QSPI_IO1: R187.2 ; port QSPI_IO1
QSPI_IO2: R188.2 ; port QSPI_IO2
QSPI_IO3: R189.2 ; port QSPI_IO3
QSPI_NCS: R185.1 ; port QSPI_NCS
REV_ID0: IC9.56(PG0) R180.1
REV_ID1: IC9.57(PG1) R181.1
REV_ID2: IC9.87(PG2) R182.1
REV_ID3: IC9.88(PG3) R183.1
RMII_CRS_DV: IC9.43(PA7) ; port RMII_CRS_DV
RMII_MDC: IC9.27(PC1) ; port RMII_MDC
RMII_MDIO: IC9.36(PA2) ; port RMII_MDIO
RMII_REF_CLK: IC9.35(PA1) ; port RMII_REF_CLK
RMII_RXD0: IC9.44(PC4) ; port RMII_RXD0
RMII_RXD1: IC9.45(PC5) ; port RMII_RXD1
RMII_TX_EN: IC9.70(PB11) ; port RMII_TX_EN
RMII_TXD0: IC9.73(PB12) ; port RMII_TXD0
RMII_TXD1: IC9.129(PG14) ; port RMII_TXD1
SCKI: IC9.128(PG13) ; port SPI6_SCK
SDI: IC9.135(PB5) ; port SPI6_MOSI
SDO: IC9.127(PG12) ; port SPI6_MISO
SPI1_MISO: R136.2 ; port SPI1_MISO
SPI1_MOSI: R128.2 ; port SPI1_MOSI
SPI1_NSS: R131.1 ; port SPI1_NSS
SPI1_SCK: R132.1 ; port SPI1_SCK
SPI2_MISO: IC9.75(PB14) ; port SPI2_MISO
SPI2_MOSI: IC9.76(PB15) ; port SPI2_MOSI
SPI2_NSS: IC9.140(PB9) ; port SPI2_NSS
SPI2_SCK: IC9.69(PB10) ; port SPI2_SCK
SPI3_MISO: IC9.134(PB4) ; port SPI3_MISO
SPI3_MOSI: IC9.113(PC12) ; port SPI3_MOSI
SPI3_SCK: IC9.111(PC10) ; port SPI3_SCK
SPI4_MISO: IC9.5(PE6) ; port SPI4_MISO
SPI4_MOSI: IC9.4(PE5) ; port SPI4_MOSI
SPI4_NSS: IC9.3(PE4) ; port SPI4_NSS
SPI4_SCK: IC9.1(PE2) ; port SPI4_CLK
SPI5_MOSI: IC9.20(PF8) ; port SPI5_MOSI
SPI5_NSS: IC9.18(PF6) ; port SPI5_NSS
SPI5_SCK: IC9.19(PF7) ; port SPI5_SCK
TCK: D28.3(I/O2) IC9.109(PA14) J8.4 R30.2
TDI: D28.1(I/O1) IC9.110(PA15) J8.8 R33.2 ; port SPI3_NSS_TDI
TDO: D28.6(I/O4) IC9.133(PB3) J8.6 R31.2
TERM_STAT0: IC9.80(PD11) ; port TERM_STAT0
TERM_STAT1: IC9.90(PG5) ; port TERM_STAT1
TMS: D28.4(I/O3) IC9.105(PA13) J8.2 R16.2
USART3_RX: IC9.78(PD9) ; port USART3_RX
USART3_TX: IC9.77(PD8) ; port USART3_TX
USB_ID: IC9.102(PA10) ; port USB_ID
USB_N: IC9.103(PA11) ; port USB_N
USB_P: IC9.104(PA12) ; port USB_P
VBUS_DET: IC9.101(PA9) ; port VBUS_DET
NetC14_2: C14.2 C31.1 IC9.32(VREF+) R95.2
NetC21_2: C21.2 IC9.23(PH0/OSC_IN) Q1.2(OSC2) R179.2
NetC23_2: C23.2 IC9.24(PH1/OSC_OUT) Q1.1(OSC1)
NetC24_1: C24.1 IC9.106(VCAP2)
NetC25_1: C25.1 IC9.71(VCAP1)
NetC136_1: C136.1 R207.1
NetD1_1: D1.1(C) IC10.2(~{RST})
NetIC9_37: IC9.37(PA3) R176.1
NetIC9_42: IC9.42(PA6) R136.1
NetIC9_48: IC9.48(PB2) R12.2
NetIC9_58: IC9.58(PE7) R186.1
NetIC9_59: IC9.59(PE8) R187.1
NetIC9_60: IC9.60(PE9) R188.1
NetIC9_63: IC9.63(PE10) R189.1
NetIC9_100: IC9.100(PA8) R177.2
NetIC9_112: IC9.112(PC11) R185.2
NetIC9_115: IC9.115(PD1) R178.2
NetIC9_123: IC9.123(PD7) R128.1
NetIC9_125: IC9.125(PG10) R131.2
NetIC9_126: IC9.126(PG11) R132.2
NetIC9_138: IC9.138(BOOT0) JP2.2(E2) R96.1
NetIC9_143: IC9.143(PDR_ON) R97.1

Not connected (* = marked no-connect by the designer): IC9 7(PC13) 26(PC0) 55(PF15) 98(PC8) 114(PD0) 132(PG15); J8 7

### Notes on the sheet
- SWAPPED Rx Tx
- (near R186) SWAPPED Rx Tx
- JTAG debuggers will conflict on SPI3_NSS pin and SWD debuggers must leave TDI high-z
- Project/Equipment
- Document
- Designer
- Drawn by
- Check.by
- Copyright WUT ISE 2018.
  This documentation describes Open Hardware and is licensed under the CERN OHL v.1.1. You may redistribute and modify this documentation under the terms of the CERN OHL v.1.1. (http://ohwr.org/CERNOHL). This documentation is distributed WITHOUT ANY EXPRESS OR IMPLIED WARRANTY, INCLUDING OF MERCHANTABILITY, SATISFACTORY QUALITY AND FITNESS FOR A PARTICULAR PURPOSE. Please see the CERN OHL v.1.1 for applicable conditions.
- Contact
- File
- Last Mod.
- Print Date
- Sheet
- Size
- A3
- of
- Rev
- (in symbol R0402_10K_1%_0.0625W_100PPM) 1%
- (in symbol R0402_49R9_1%_0.0625W_100PPM) 1%
- (in symbol R0603_1K_1%_0.1W_100PPM) 1%
- (in symbol R0603_30R_1%_0.1W_100PPM) 1%

### Library data of the parts
C14 C24 C25 C107 = CC0603_2.2UF_10V_20%_X7R: Non-polarised capacitor; Part Description: SMD Multilayer Chip Ceramic Capacitor; Manufacturer: GENERIC; Manufacturer1 Part Number: LMK107B7225MA-T; Voltage: 10V; TC: X7R; Tolerance: ±20%; Part Number: CC0603_2.2UF_10V_20%_X7R; Component Kind: Standard; Component Type: Standard; Pin Count: 2; Value: 2.2uF; Status: Not Recommended; Manufacturer Part Number: CC0603_2.2UF_10V_20%_X7R; Case: 0603; Mounted: Yes; Socket: No; SMD: Yes; Sense: No; Manufacturer1 Example: TAIYO YUDEN; Manufacturer1 ComponentHeight: 0.9mm; HelpURL: \\cern.ch\dfs\Applications\Altium\Datasheets\CC0603_X7R_TAIYO-YUDEN_HIGH-VALUE.pdf; Author: CERN DEM JLC; CreateDate: 22/06/2011; LatestRevisionDate: 27/06/2011
C15 C31 C35 C37 C38 C41 C43 C57 C67 C70-C74 = CC0402_100NF_16V_10%_X5R: as C79-C81 on sheet RMII_Ethernet; Value: 100nF; Part Number: CC0402_100NF_16V_10%_X5R; Component Kind: Standard; Component Type: Standard; Pin Count: 2; Status: None; Manufacturer Part Number: CC0402_100NF_16V_10%_X5R; Case: 0402; Mounted: Yes; Socket: No; SMD: Yes; Sense: No; Manufacturer1 Example: MURATA; Manufacturer1 ComponentHeight: 0.55mm; HelpURL: \\cern.ch\dfs\Applications\Altium\Datasheets\CC0402_X5R_MURATA_GRM.pdf; Author: CERN DEM JLC; CreateDate: 10/12/2013; LatestRevisionDate: 10/12/2013
C21 C23 = CC0402_22PF_50V_5%_C0G: Non-polarised capacitor; Part Description: SMD Multilayer Chip Ceramic Capacitor; Manufacturer: GENERIC; Manufacturer1 Part Number: C0402C220J5GACTU; Voltage: 50V; TC: C0G/NP0; Tolerance: ±5%; Part Number: CC0402_22PF_50V_5%_C0G; Component Kind: Standard; Component Type: Standard; Pin Count: 2; Value: 22pF; Status: Preferred; Manufacturer Part Number: CC0402_22PF_50V_5%_C0G; Case: 0402; Mounted: Yes; Socket: No; SMD: Yes; Sense: No; Manufacturer1 Example: KEMET; Manufacturer1 ComponentHeight: 0.55mm; HelpURL: \\cern.ch\dfs\Applications\Altium\Datasheets\CC0805_C0G_KEMET_(Commercial Grade).pdf; Author: CERN DEM JLC; CreateDate: 03/12/2007; LatestRevisionDate: 03/12/2007
C78 = CC0805_10UF_25V_10%_X5R: Non-polarised capacitor; Part Description: SMD Multilayer Chip Ceramic Capacitor; Manufacturer: GENERIC; Manufacturer1 Part Number: GRM219R61E106KA12D; Voltage: 25V; TC: X5R; Tolerance: ±10%; Part Number: CC0805_10UF_25V_10%_X5R; Component Kind: Standard; Component Type: Standard; Pin Count: 2; Value: 10uF; Status: Preferred; Manufacturer Part Number: CC0805_10UF_25V_10%_X5R; Case: 0805; Mounted: Yes; Socket: No; SMD: Yes; Sense: No; Manufacturer1 Example: MURATA; Manufacturer1 ComponentHeight: 0.95mm; HelpURL: \\cern.ch\dfs\Applications\Altium\Datasheets\CC0805_X5R_MURATA_GRM.pdf; Author: CERN DEM JLC; CreateDate: 25.10.2012; LatestRevisionDate: 06.09.2016
C136 = CC0603_150PF_50V_1%_NP0: Non-polarised capacitor; Part Description: SMD Multilayer Chip Ceramic Capacitor; Manufacturer: GENERIC; Manufacturer1 Part Number: CC0603FRNPO9BN151; Voltage: 50V; TC: C0G/NP0; Tolerance: ±1%; Part Number: CC0603_150PF_50V_1%_NP0; Component Kind: Standard; Component Type: Standard; Pin Count: 2; Value: 150pF; Status: None; Manufacturer Part Number: CC0603_150PF_50V_1%_NP0; Case: 0603; Mounted: Yes; Socket: No; SMD: Yes; Sense: No; Manufacturer1 Example: PHYCOMP; Manufacturer1 ComponentHeight: 0.7mm; HelpURL: \\cern.ch\dfs\Applications\Altium\Datasheets\CC0805_NP0_PHYCOMP_16VTO50V.pdf; Author: CERN DEM MR; CreateDate: 17.02.2016; LatestRevisionDate: 17.02.2016
D1 = SS16: as D7 on sheet RMII_Ethernet; Part Number: SS16; Component Kind: Standard; Component Type: Standard; Device: SS16; PackageDescription: DO-214-AC Molded Diode, Body 5.1x2.7mm, IPC Medium Density; Manufacturer Part Number: SS16; Pin Count: 2; Case: DO-214AC; Mounted: Yes; Socket: No; SMD: Yes; Sense: No; ComponentHeight: 2.29mm; HelpURL: \\cern.ch\dfs\Applications\Altium\Datasheets\SS16.pdf; Author: CERN DEM JLC; CreateDate: 15.07.2008; LatestRevisionDate: 23.08.2010
D28 = D_TVS_DRTR5V0U4S-7: as D3 on sheet RMII_Ethernet; Part Number: DRTR5V0U4S-7; Component Kind: Standard; Component Type: Standard; Device: DRTR5V0U4S-7; PackageDescription: SOT363, SC70-6, 0.65mm Pitch; 6 Pin, 1.25mm W X 2.00mm L X 1.10mm H body, IPC Medium Density; Status: Active; Manufacturer Part Number: DRTR5V0U4S-7; Pin Count: 6; Case: SOT363; Mounted: Yes; Socket: No; SMD: Yes; Sense: No; ComponentHeight: 1.1mm; HelpURL: \\cern.ch\dfs\Applications\Altium\Datasheets\PRTR5V0U4Y.pdf; Author: GK; CreateDate: 24.01.2017; LatestRevisionDate: 14.09.2020
IC9 = UPC_STM32H743ZIT6: 32-bit Arm® Cortex-M7 400MHz MCUs, up to 2MB Flash, / 1MB RAM, 46 com. and analog interfaces
IC10 = VMON_STM809: 2.93V  Reset circuit
J8 = CON_2x10 1.27 SMT_male_HARWIN: 10 Contacts - Pitch 1.27mm - Dual Row SMT Vertical Pin Header (Post Lead = 3mm, Insulator 1mm); Manufacturer: HARWIN; PressFit: No; Part Number: HARWIN_M50-3600542; Component Kind: Standard; Component Type: Standard; Pin Count: 10; Family: Header 10; Mounted: Yes; Socket: No; SMD: Yes; Sense: No; Status: None; Part Description: 10 Contacts - Pitch 1.27mm - Dual Row SMT Vertical Pin Header (Post Lead = 3mm, Insulator 1mm); ComponentHeight: 5.13mm; HelpURL: \\cern.ch\dfs\Applications\Altium\Datasheets\HARWIN_M50-3600842.pdf; Author: GK; CreateDate: 15.03.2017; LatestRevisionDate: 22.05.2017
JP2 = JUMPER: Supplier 1: Farnell; Supplier Part Number 1: 1798942
L15 = IND0402_MURATA_BLM15HD601SN1: as L7 on sheet RMII_Ethernet; Part Number: IND0402_MURATA_BLM15HD601SN1; Component Kind: Standard; Component Type: Standard; Pin Count: 2; Value: 600R@100MHz; Status: None; Case: 0402; Mounted: Yes; Socket: No; SMD: Yes; Sense: No; ComponentHeight: 0.55mm; HelpURL: \\cern.ch\dfs\Applications\Altium\Datasheets\IND0402_MURATA_BLM15H.pdf; Author: CERN DEM JLC; CreateDate: 28/02/2012; LatestRevisionDate: 28/02/2012
Q1 = XTAL_8MHZ_TXC_7A-8.000MAAE-T: Quartz Crystal; Part Description: Tolerance: ±30ppm, Stability: ±30ppm, -20°C to +70°C, 12pF, SMD Glass Seam Sealing Crystal, 7A Series; Manufacturer: TXC CORPORATION; PressFit: No; Bonding: No; Part Number: XTAL_8MHZ_TXC_7A-8.000MAAE-T; Component Kind: Standard; Component Type: Standard; PackageDescription: 2 Pins, 3.2x5mm, SMD Glass Seam Sealing Crystal, 7A Serie; Value: 8MHz; Manufacturer Part Number: 7A-8.000MAAE-T; Pin Count: 2; Mounted: Yes; Socket: No; SMD: Yes; Sense: No; ComponentHeight: 1.2mm; HelpURL: \\cern.ch\dfs\Applications\Altium\Datasheets\XTAL_TXC_7A.pdf; Author: CERN DEM JLC; CreateDate: 09/10/2014; LatestRevisionDate: 12/11/2014
R12 R128 R131 R132 R136 R185-R189 R207 = R0402_49R9_1%_0.0625W_100PPM: as R36 on sheet RMII_Ethernet; Part Number: R0402_49R9_1%_0.0625W_100PPM; Component Kind: Standard; Component Type: Standard; Pin Count: 2; Value: 49R9; Status: Not recommended; Power: 0.0625W; Tolerance: ±1%; Manufacturer Part Number: R0402_49R9_1%_0.0625W_100PPM; Case: 0402; Mounted: Yes; Socket: No; SMD: Yes; Manufacturer1 Example: YAGEO PHYCOMP; Manufacturer1 ComponentHeight: 0.4mm; HelpURL: \\cern.ch\dfs\Applications\Altium\Datasheets\R0402_Phycomp_RC0402.pdf; Author: CERN DEM JLC; CreateDate: 2012-10-24; LatestRevisionDate: 2012-10-24
R13 R96 = R0402_10K_1%_0.0625W_100PPM: as R42-R44 on sheet RMII_Ethernet; Value: 10k; Part Number: R0402_10K_1%_0.0625W_100PPM; Component Kind: Standard; Component Type: Standard; Pin Count: 2; Status: Not Recommended; Power: 0.0625W; Tolerance: ±1%; Manufacturer Part Number: R0402_10K_1%_0.0625W_100PPM; Case: 0402; Mounted: Yes; Sense: No; Socket: No; SMD: Yes; Manufacturer1 Example: YAGEO PHYCOMP; Manufacturer1 ComponentHeight: 0.4mm; HelpURL: \\cern.ch\dfs\Applications\Altium\Datasheets\R0402_Phycomp_RC0402.pdf; Author: CERN DEM JLC; CreateDate: 03/12/2007; LatestRevisionDate: 17/10/2012
R14 R97 = R0402_0R_JUMPER: Resistor; Part Description: 1A (0.05R Max DC Resistance) Zero Ohm Jumper; Manufacturer: GENERIC; Manufacturer1 Part Number: 232270591001L; PressFit: No; Part Number: R0402_0R_JUMPER; Component Kind: Standard; Component Type: Standard; Pin Count: 2; Value: 0; Status: Not Recommended; Manufacturer Part Number: R0402_0R_JUMPER; Case: 0402; Mounted: Yes; Sense: No; Socket: No; SMD: Yes; Manufacturer1 Example: YAGEO PHYCOMP; Manufacturer1 ComponentHeight: 0.4mm; HelpURL: \\cern.ch\dfs\Applications\Altium\Datasheets\R0402_Phycomp_RC0402.pdf; Author: CERN DEM JLC; CreateDate: 03/12/2007; LatestRevisionDate: 17/10/2012
R16 R30 R31 R33 = R0402_10K_1%_0.0625W_100PPM: Resistor - 1%; Part Description: General Purpose Thick Film Chip Resistor; Manufacturer: GENERIC; Manufacturer1 Part Number: 232270671003L; TC: ±100ppm/°C; Table: Resistors SMD; Part Number: R0402_10K_1%_0.0625W_100PPM; Component Kind: Standard; Component Type: Standard; Pin Count: 2; Value: 10k; Status: Not recommended; Power: 0.0625W; Tolerance: ±1%; Manufacturer Part Number: R0402_10K_1%_0.0625W_100PPM; Case: 0402; Mounted: Yes; Socket: No; SMD: Yes; Manufacturer1 Example: YAGEO PHYCOMP; Manufacturer1 ComponentHeight: 0.4mm; HelpURL: \\cern.ch\dfs\Applications\Altium\Datasheets\R0402_Phycomp_RC0402.pdf; Author: CERN DEM JLC; CreateDate: 2007-12-03; LatestRevisionDate: 2012-10-17
R95 = R0603_30R_1%_0.1W_100PPM: Resistor - 1%; Part Description: General Purpose Thick Film Chip Resistor; Manufacturer: GENERIC; Manufacturer1 Part Number: NRC06F30R0TRF; Power: 0.1W; TC: ±100ppm/°C; PressFit: No; Part Number: R0603_30R_1%_0.1W_100PPM; Component Kind: Standard; Component Type: Standard; Pin Count: 2; Value: 30; Status: Preferred; Tolerance: ±1%; Manufacturer Part Number: R0603_30R_1%_0.1W_100PPM; Case: 0603; Mounted: Yes; Sense: No; Socket: No; SMD: Yes; Manufacturer1 Example: NIC COMPONENT; Manufacturer1 ComponentHeight: 0.55mm; HelpURL: \\cern.ch\dfs\Applications\Altium\Datasheets\R0603_NIC_NRC.pdf; Author: CERN DEM JLC; CreateDate: 03.12.2007; LatestRevisionDate: 13.03.2008
R167 R169 R176-R179 = R0603_0R_JUMPER: as R135 on sheet RMII_Ethernet; Part Number: R0603_0R_JUMPER; Component Kind: Standard; Component Type: Standard; Pin Count: 2; Value: 0; Status: Preferred; Manufacturer Part Number: R0603_0R_JUMPER; Case: 0603; Mounted: Yes; Sense: No; Socket: No; SMD: Yes; Manufacturer1 Example: NIC COMPONENT; Manufacturer1 ComponentHeight: 0.55mm; HelpURL: \\cern.ch\dfs\Applications\Altium\Datasheets\R0603_NIC_NRC.pdf; Author: CERN DEM JLC; CreateDate: 03.12.2007; LatestRevisionDate: 13.03.2008
R180-R183 = R0603_1K_1%_0.1W_100PPM: Resistor - 1%; Part Description: General Purpose Thick Film Chip Resistor; Manufacturer: GENERIC; Manufacturer1 Part Number: NRC06F1001TRF; Power: 0.1W; TC: ±100ppm/°C; PressFit: No; Part Number: R0603_1K_1%_0.1W_100PPM; Component Kind: Standard; Component Type: Standard; Pin Count: 2; Value: 1k; Status: Preferred; Tolerance: ±1%; Manufacturer Part Number: R0603_1K_1%_0.1W_100PPM; Case: 0603; Mounted: Yes; Sense: No; Socket: No; SMD: Yes; Manufacturer1 Example: NIC COMPONENT; Manufacturer1 ComponentHeight: 0.55mm; HelpURL: \\cern.ch\dfs\Applications\Altium\Datasheets\R0603_NIC_NRC.pdf; Author: CERN DEM JLC; CreateDate: 03/12/2007; LatestRevisionDate: 13/03/2008